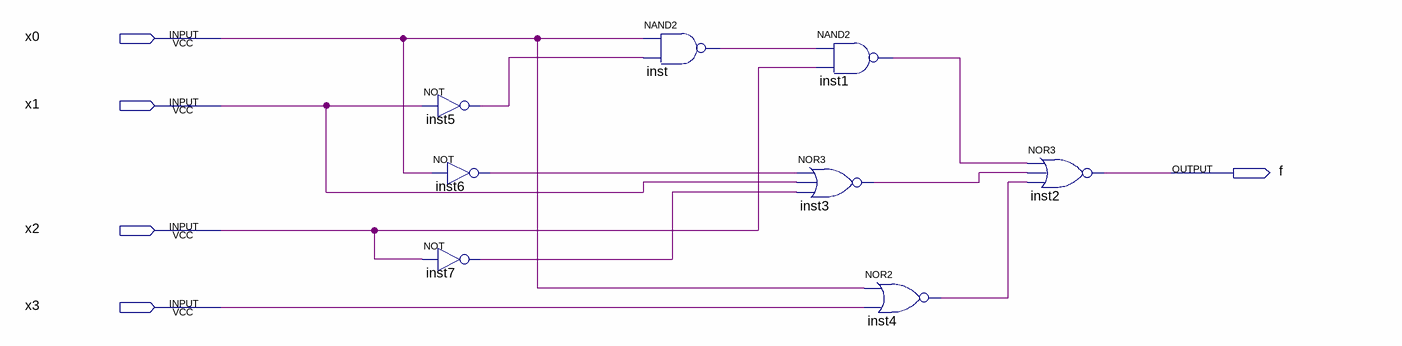
[diagram p0: schematic sheet]
// Quartus schematic lab1.bdf as structural Verilog: 8 symbols, 5 pins
module lab1 (
  input  x0,
  input  x1,
  input  x2,
  input  x3,
  output f
);

  wire inst1_out, inst3_out, inst4_out, inst5_out, inst6_out, inst7_out, inst_out;

  not inst5 (inst5_out, x1);
  not inst6 (inst6_out, x0);
  not inst7 (inst7_out, x2);
  nand inst (inst_out, x0, inst5_out);
  nand inst1 (inst1_out, inst_out, x2);
  nor inst3 (inst3_out, inst6_out, x1, inst7_out);
  nor inst4 (inst4_out, x0, x3);
  nor inst2 (f, inst1_out, inst3_out, inst4_out);
endmodule
